# EAGLE schematic BE_PROJECT_PCB_final (EAGLE 9.5.2)

## Sheet 1 of 3
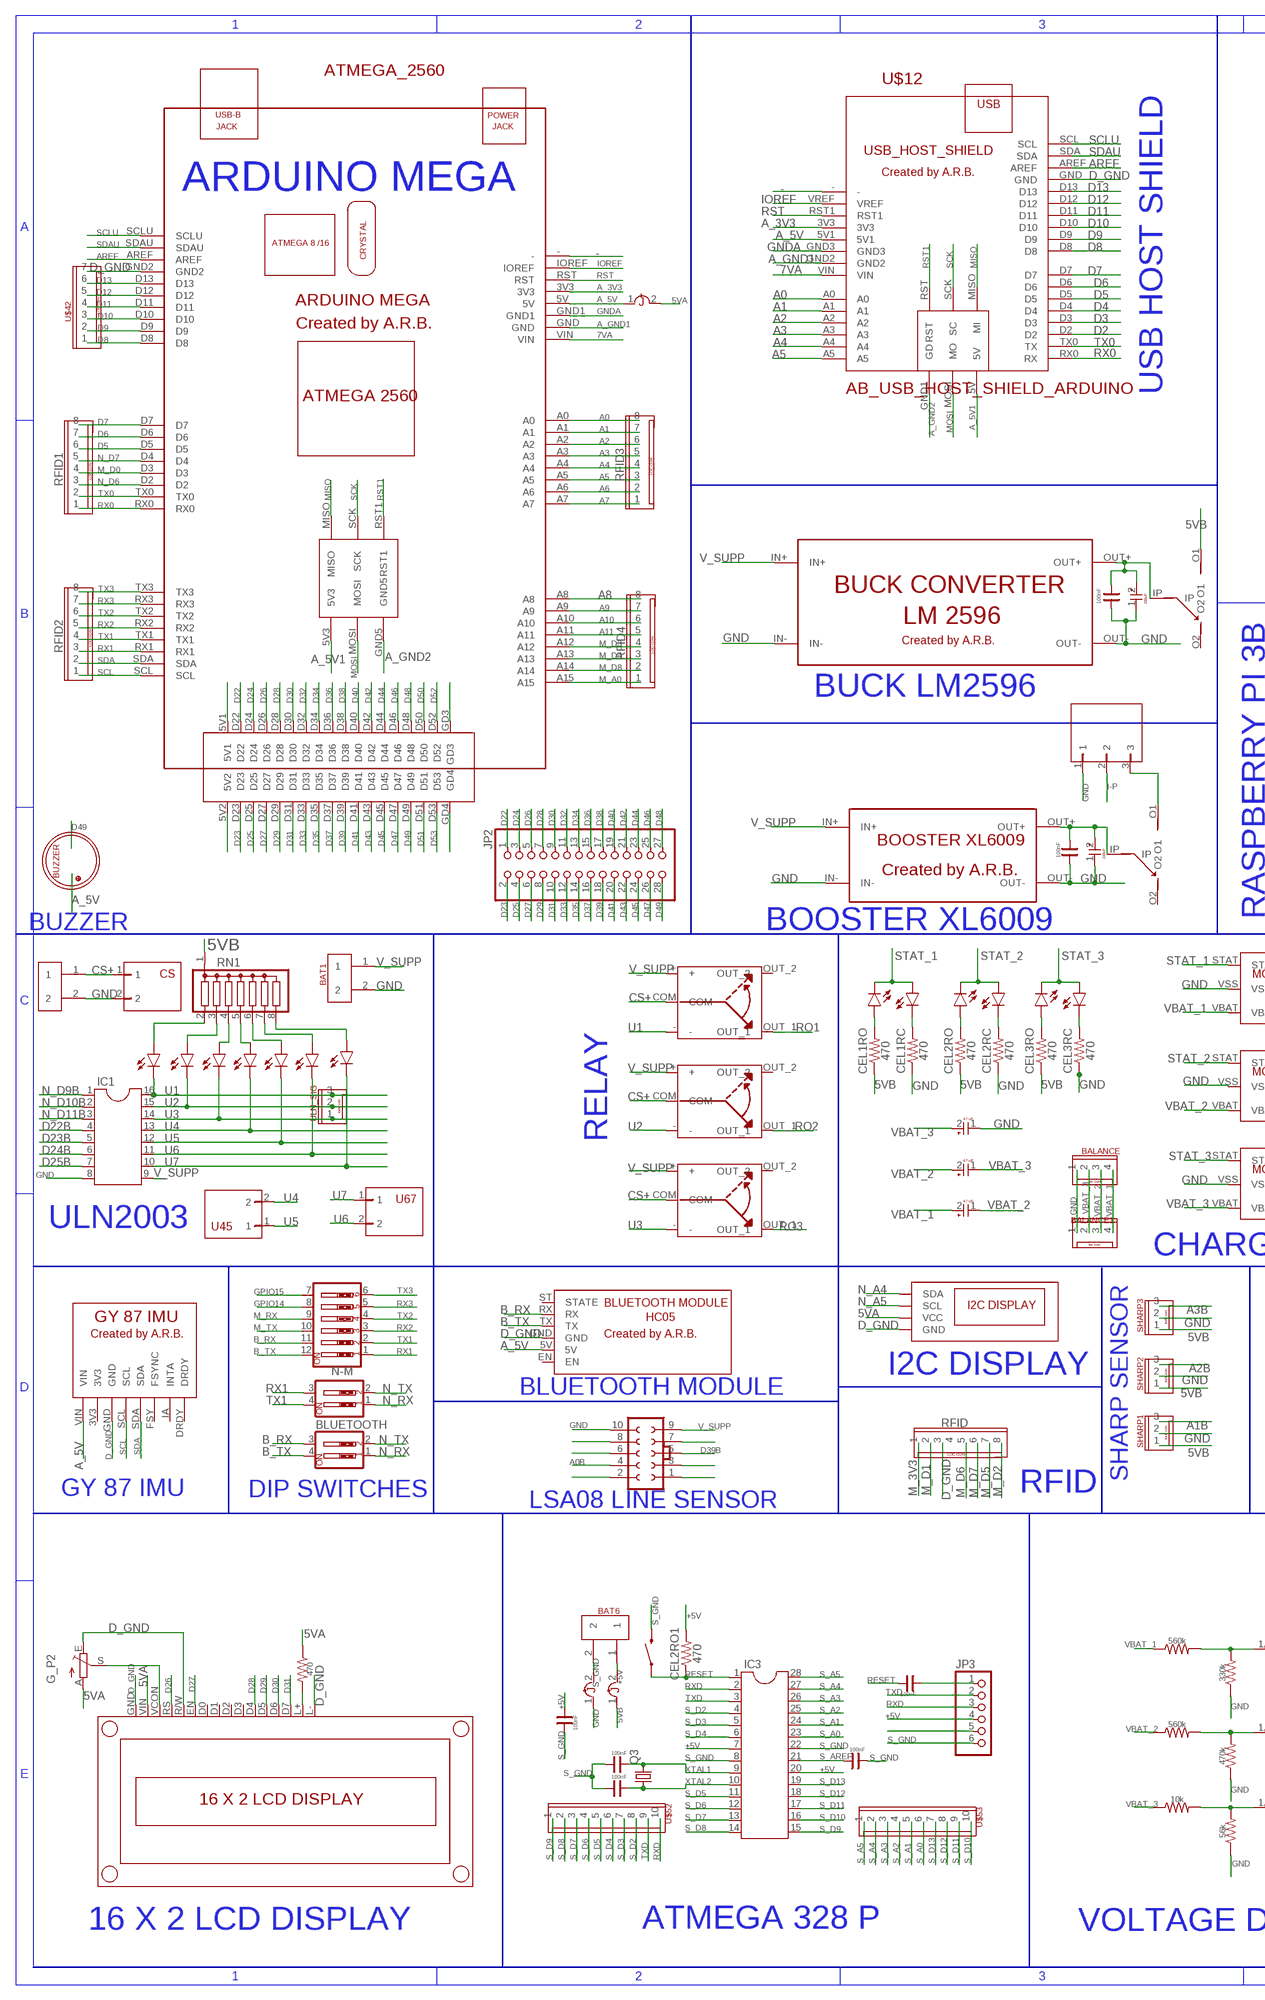
[diagram p0: schematic, sheet 1, part 1 of 3]
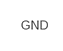
[diagram p1: schematic, sheet 1, part 2 of 3]
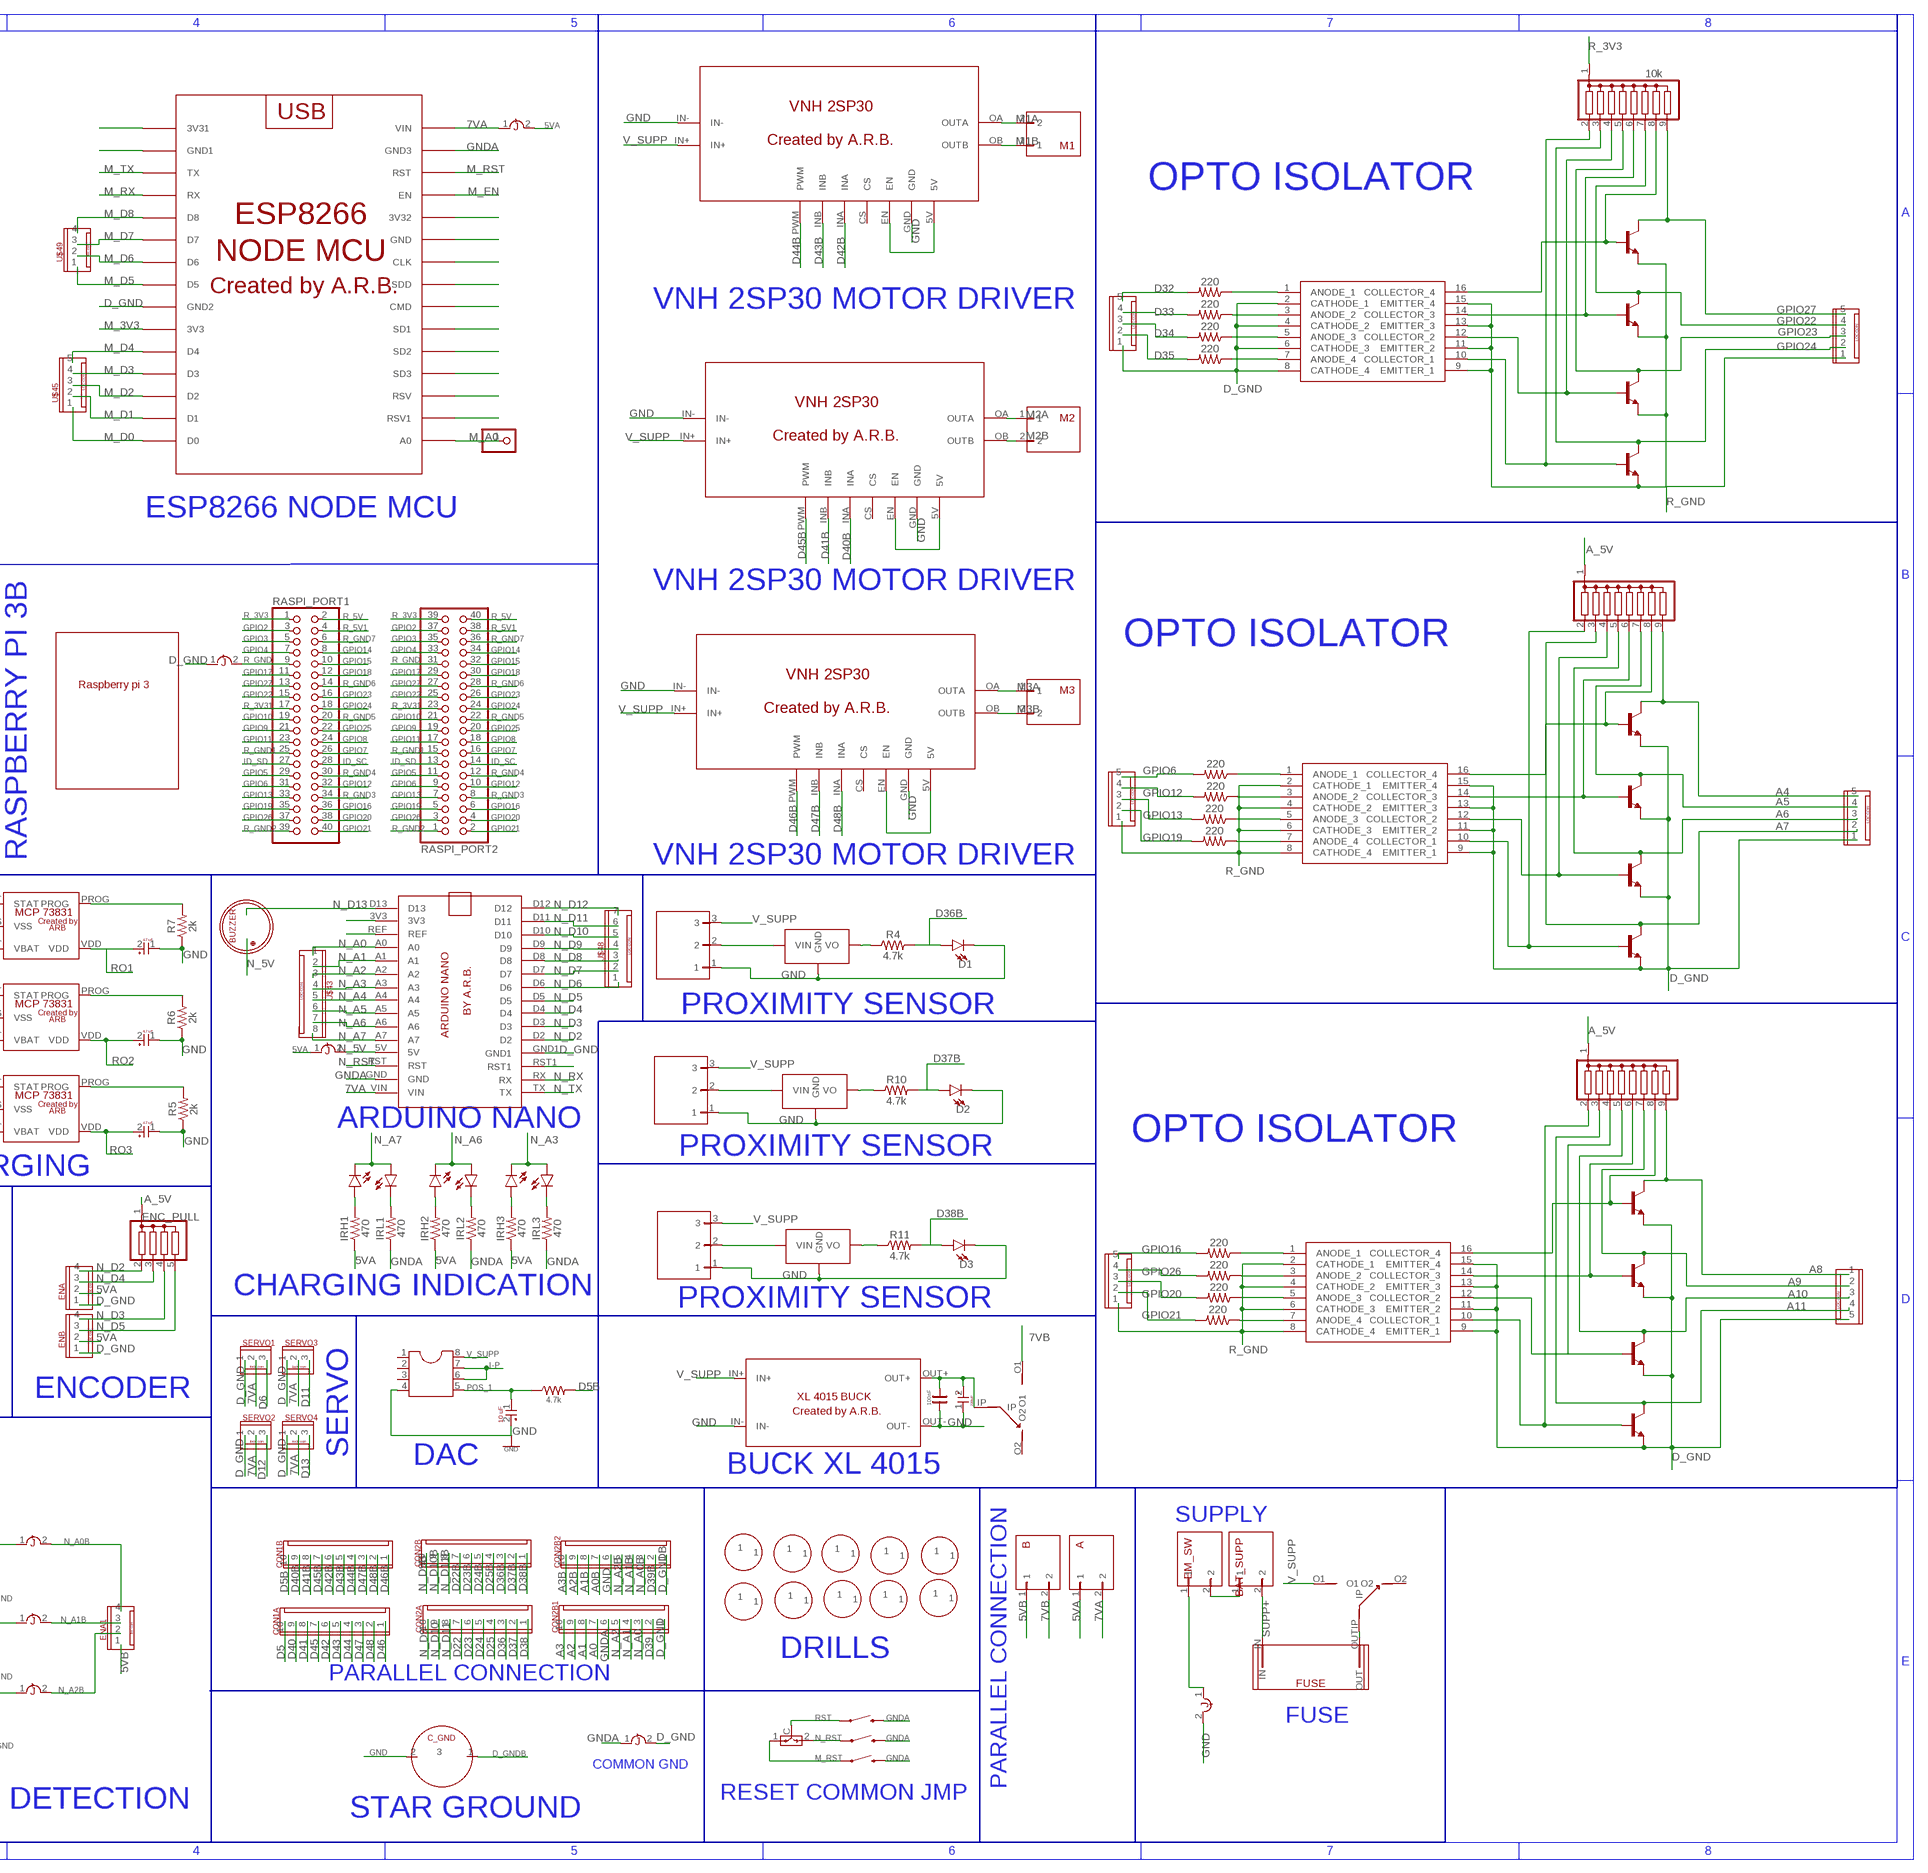
[diagram p2: schematic, sheet 1, part 3 of 3]

### Parts
10K  10k  G08R  [SIL9]
A  AB_RIGHT_TER_BLK  [AB_RIGHT_TER_BLK]
ATMEGA_2560  AB_ARDUINO_MEGA  [AB_ARDUINO_MEGA]
B  AB_RIGHT_TER_BLK  [AB_RIGHT_TER_BLK]
BALANCE  AB_4PIN_LOC_CONNECTOR  [AB_4PIN_LOC_CONNECTOR]
BALANCE1  AB_4PIN_LOC_CONNECTOR  [AB_4PIN_LOC_CONNECTOR]
BAT1  AB_SCREW_TERMINAL_5MM_2PIN  [AB_SCREW_TERMINAL_5MM_2PIN]
BAT6  AB_SCREW_TERMINAL_5MM_2PIN  [AB_SCREW_TERMINAL_5MM_2PIN]
BAT_SUPP  AB_RIGHT_TER_BLK  [AB_RIGHT_TER_BLK]
BC547  BC547  [TO92]
BLUETOOTH  SW_DIP-2  [EDG-02]
C1  100nF  CNP-C020-035X018  [C020-035X018]
C2  100nF  CNP-C020-035X018  [C020-035X018]
C3  100nF  CNP-C020-035X018  [C020-035X018]
C4  100nF  CNP-C020-035X018  [C020-035X018]
C5  100nF  CNP-C020-035X018  [C020-035X018]
C6  100nF  CNP-C020-035X018  [C020-035X018]
C7  100nF  CNP-C020-035X018  [C020-035X018]
C8  100nF  CNP-C020-035X018  [C020-035X018]
C_GND  AB_JOINT_GND  [AB_JOINT_GND]
CEL1CC  LED-3MM-NO_SILK  [LED_3MM-NS]
CEL1CO  LED-3MM-NO_SILK  [LED_3MM-NS]
CEL1RC  470  RESISTORAXIAL-0.3  [AXIAL-0.3]
CEL1RO  470  RESISTORAXIAL-0.3  [AXIAL-0.3]
CEL2CC  LED-3MM-NO_SILK  [LED_3MM-NS]
CEL2CO  LED-3MM-NO_SILK  [LED_3MM-NS]
CEL2RC  470  RESISTORAXIAL-0.3  [AXIAL-0.3]
CEL2RO  470  RESISTORAXIAL-0.3  [AXIAL-0.3]
CEL2RO1  470  RESISTORAXIAL-0.3  [AXIAL-0.3]
CEL3CC  LED-3MM-NO_SILK  [LED_3MM-NS]
CEL3CO  LED-3MM-NO_SILK  [LED_3MM-NS]
CEL3RC  470  RESISTORAXIAL-0.3  [AXIAL-0.3]
CEL3RO  470  RESISTORAXIAL-0.3  [AXIAL-0.3]
CON1A  AB_10PIN_LOC_CONNECTOR  [AB_10PIN_LOC_CONNECTOR]
CON1B  AB_10PIN_LOC_CONNECTOR  [AB_10PIN_LOC_CONNECTOR]
CON2A  AB_10PIN_LOC_CONNECTOR  [AB_10PIN_LOC_CONNECTOR]
CON2B  AB_10PIN_LOC_CONNECTOR  [AB_10PIN_LOC_CONNECTOR]
CON2B1  AB_10PIN_LOC_CONNECTOR  [AB_10PIN_LOC_CONNECTOR]
CON2B2  AB_10PIN_LOC_CONNECTOR  [AB_10PIN_LOC_CONNECTOR]
CS  AB_RIGHT_TER_BLK  [AB_RIGHT_TER_BLK]
D1  LED-3MM-NO_SILK  [LED_3MM-NS]
D2  LED-3MM-NO_SILK  [LED_3MM-NS]
D3  LED-3MM-NO_SILK  [LED_3MM-NS]
EM_SW  AB_RIGHT_TER_BLK  [AB_RIGHT_TER_BLK]
ENA  AB_4PIN_LOC_CONNECTOR  [AB_4PIN_LOC_CONNECTOR]
ENA1  AB_4PIN_LOC_CONNECTOR  [AB_4PIN_LOC_CONNECTOR]
ENB  AB_4PIN_LOC_CONNECTOR  [AB_4PIN_LOC_CONNECTOR]
ENC_PULL  G04R  [SIL5]
FUSE  AB_FUSE_HOLDER  [AB_FUSE_HOLDER]
G_P2  TRIM_EU-RS3  [RS3]
IC1  DIL16S  [SOCKET-16]
IC2  DIL8S  [SOCKET-08]
IC3  DIL28-3  [DIL28-3]
IC8  TLP281-4(GB,J,F)  [SOIC127P700X210-16N]
IC9  TLP281-4(GB,J,F)  [SOIC127P700X210-16N]
IC10  TLP281-4(GB,J,F)  [SOIC127P700X210-16N]
IH1  LED-3MM-NO_SILK  [LED_3MM-NS]
IH2  LED-3MM-NO_SILK  [LED_3MM-NS]
IH3  LED-3MM-NO_SILK  [LED_3MM-NS]
IL1  LED-3MM-NO_SILK  [LED_3MM-NS]
IL2  LED-3MM-NO_SILK  [LED_3MM-NS]
IL3  LED-3MM-NO_SILK  [LED_3MM-NS]
IRH1  470  RESISTORAXIAL-0.3  [AXIAL-0.3]
IRH2  470  RESISTORAXIAL-0.3  [AXIAL-0.3]
IRH3  470  RESISTORAXIAL-0.3  [AXIAL-0.3]
IRL1  470  RESISTORAXIAL-0.3  [AXIAL-0.3]
IRL2  470  RESISTORAXIAL-0.3  [AXIAL-0.3]
IRL3  470  RESISTORAXIAL-0.3  [AXIAL-0.3]
JP1  PINHD-1X1  [1X01]
JP2  PINHD-2X14  [2X14]
JP3  PINHD-1X6  [1X06]
L1  LED-3MM-NO_SILK  [LED_3MM-NS]
L2  LED-3MM-NO_SILK  [LED_3MM-NS]
L3  LED-3MM-NO_SILK  [LED_3MM-NS]
L4  LED-3MM-NO_SILK  [LED_3MM-NS]
L5  LED-3MM-NO_SILK  [LED_3MM-NS]
L6  LED-3MM-NO_SILK  [LED_3MM-NS]
L7  LED-3MM-NO_SILK  [LED_3MM-NS]
LSA_2  LSA1  SOCKET-10V  [S10V]
M1  AB_RIGHT_TER_BLK  [AB_RIGHT_TER_BLK]
M2  AB_RIGHT_TER_BLK  [AB_RIGHT_TER_BLK]
M3  AB_RIGHT_TER_BLK  [AB_RIGHT_TER_BLK]
M_RST  MOMENTARY-SWITCH-SPST-PTH-6.0MM  [TACTILE_SWITCH_PTH_6.0MM]
MEGA_RST  MOMENTARY-SWITCH-SPST-PTH-6.0MM  [TACTILE_SWITCH_PTH_6.0MM]
MEGA_RST1  MOMENTARY-SWITCH-SPST-PTH-6.0MM  [TACTILE_SWITCH_PTH_6.0MM]
N-M  SW_DIP-2  [EDG-02]
N_RST  MOMENTARY-SWITCH-SPST-PTH-6.0MM  [TACTILE_SWITCH_PTH_6.0MM]
NANO  AB_JUMPER_ONE_WAY  [AB_JUMPER_ONE_WAY]
NODEMCU  AB_JUMPER_ONE_WAY  [AB_JUMPER_ONE_WAY]
OISO1  AB_5PIN_LOC_CONNECTOR  [AB_5PIN_LOC_CONNECTOR]
OISO2  AB_5PIN_LOC_CONNECTOR  [AB_5PIN_LOC_CONNECTOR]
OISO3  AB_5PIN_LOC_CONNECTOR  [AB_5PIN_LOC_CONNECTOR]
OISO4  AB_5PIN_LOC_CONNECTOR  [AB_5PIN_LOC_CONNECTOR]
OISO5  AB_5PIN_LOC_CONNECTOR  [AB_5PIN_LOC_CONNECTOR]
OISO6  AB_5PIN_LOC_CONNECTOR  [AB_5PIN_LOC_CONNECTOR]
PPR_R1  4.7k  RESISTORAXIAL-0.3  [AXIAL-0.3]
PROX1  AB_RIGHT_TER_BLK_3PIN  [AB_RIGHT_TER_BLK_3PIN]
PROX2  AB_RIGHT_TER_BLK_3PIN  [AB_RIGHT_TER_BLK_3PIN]
PROX3  AB_RIGHT_TER_BLK_3PIN  [AB_RIGHT_TER_BLK_3PIN]
Q3  CRYSTALHC49U-V  [HC49U-V]
R2  560k  RESISTORAXIAL-0.3  [AXIAL-0.3]
R4  4.7k  RESISTORAXIAL-0.3  [AXIAL-0.3]
R5  2k  RESISTORAXIAL-0.3  [AXIAL-0.3]
R6  2k  RESISTORAXIAL-0.3  [AXIAL-0.3]
R7  2k  RESISTORAXIAL-0.3  [AXIAL-0.3]
R10  4.7k  RESISTORAXIAL-0.3  [AXIAL-0.3]
R11  4.7k  RESISTORAXIAL-0.3  [AXIAL-0.3]
R17  470  RESISTORAXIAL-0.3  [AXIAL-0.3]
R18  220  RESISTORAXIAL-0.3  [AXIAL-0.3]
R19  220  RESISTORAXIAL-0.3  [AXIAL-0.3]
R20  220  RESISTORAXIAL-0.3  [AXIAL-0.3]
R21  220  RESISTORAXIAL-0.3  [AXIAL-0.3]
R22  220  RESISTORAXIAL-0.3  [AXIAL-0.3]
R23  220  RESISTORAXIAL-0.3  [AXIAL-0.3]
R24  220  RESISTORAXIAL-0.3  [AXIAL-0.3]
R25  220  RESISTORAXIAL-0.3  [AXIAL-0.3]
R26  220  RESISTORAXIAL-0.3  [AXIAL-0.3]
R27  220  RESISTORAXIAL-0.3  [AXIAL-0.3]
R28  220  RESISTORAXIAL-0.3  [AXIAL-0.3]
R32  220  RESISTORAXIAL-0.3  [AXIAL-0.3]
R34  330k  RESISTORAXIAL-0.3  [AXIAL-0.3]
R35  560k  RESISTORAXIAL-0.3  [AXIAL-0.3]
R36  470k  RESISTORAXIAL-0.3  [AXIAL-0.3]
R37  10k  RESISTORAXIAL-0.3  [AXIAL-0.3]
R38  56k  RESISTORAXIAL-0.3  [AXIAL-0.3]
RASPI_PORT1  PINHD-2X20  [2X20]
RASPI_PORT2  PINHD-2X20  [2X20]
REL1  12v  AB_ELECTROMAGNETIC_RELAY  [AB_ELECTROMAGNETIC_RELAY]
REL2  12v  AB_ELECTROMAGNETIC_RELAY  [AB_ELECTROMAGNETIC_RELAY]
REL3  12v  AB_ELECTROMAGNETIC_RELAY  [AB_ELECTROMAGNETIC_RELAY]
RFID  AB_8PIN_LOC_CONNECTOR  [AB_8PIN_LOC_CONNECTOR]
RFID1  AB_8PIN_LOC_CONNECTOR  [AB_8PIN_LOC_CONNECTOR]
RFID2  AB_8PIN_LOC_CONNECTOR  [AB_8PIN_LOC_CONNECTOR]
RFID3  AB_8PIN_LOC_CONNECTOR  [AB_8PIN_LOC_CONNECTOR]
RFID4  AB_8PIN_LOC_CONNECTOR  [AB_8PIN_LOC_CONNECTOR]
RN1  G07R  [SIL8]
RN6  G08R  [SIL9]
RN7  G08R  [SIL9]
SERVO1  AB_3PIN_LOC_CONNECTOR  [AB_3PIN_LOC_CONNECTOR]
SERVO2  AB_3PIN_LOC_CONNECTOR  [AB_3PIN_LOC_CONNECTOR]
SERVO3  AB_3PIN_LOC_CONNECTOR  [AB_3PIN_LOC_CONNECTOR]
SERVO4  AB_3PIN_LOC_CONNECTOR  [AB_3PIN_LOC_CONNECTOR]
SHARP1  AB_3PIN_LOC_CONNECTOR  [AB_3PIN_LOC_CONNECTOR]
SHARP2  AB_3PIN_LOC_CONNECTOR  [AB_3PIN_LOC_CONNECTOR]
SHARP3  AB_3PIN_LOC_CONNECTOR  [AB_3PIN_LOC_CONNECTOR]
SW1  SW_DIP-6  [EDG-06]
TR14  BC547  [TO92]
TR15  BC547  [TO92]
TR16  BC547  [TO92]
TR17  BC547  [TO92]
TR18  BC547  [TO92]
TR19  BC547  [TO92]
TR20  BC547  [TO92]
TR21  BC547  [TO92]
TR22  BC547  [TO92]
TR23  BC547  [TO92]
TR24  BC547  [TO92]
U45  AB_RIGHT_TER_BLK  [AB_RIGHT_TER_BLK]
U67  AB_RIGHT_TER_BLK  [AB_RIGHT_TER_BLK]
U$1  AB_JUMPER_ONE_WAY  [AB_JUMPER_ONE_WAY]
U$2  AB_16X2_LCD_DISPLAY  [AB_16X2_LCD_DISPLAY]
U$3  AB_VNH2SP30  [AB_VNH2SP30_MODULE]
U$4  ESP8266_NODEMCU_BY_AB  [AB_ESP8266_BREAKOUT]
U$5  AB_RASPBERRY_PI_3  [AB_RASPBERRY_PI_3]
U$6  AB_VNH2SP30  [AB_VNH2SP30_MODULE]
U$7  AB_LM2596_BUCK_CONVERTER  [AB_LM2596_BUCK_CONVERTER]
U$8  AB_XL6009_BOOST_CONVERTER  [AB_XL6009E1_BOOST_CONVERTER]
U$9  AB_VNH2SP30  [AB_VNH2SP30_MODULE]
U$10  AB_GY87  [AB_IMU_GY87]
U$11  AB_BLUETOOTH_HC05  [AB_BLUETOOTH_HC05]
U$12  AB_USB_HOST_SHIELD_ARDUINO  [AB_USB_HOST_SHIELD_ARDUINO]
U$13  AB_XL4015_5A_  [AB_XL_4015_5A_BUCK]
U$14  AB_SW  [AB_SW]
U$15  AB_SW  [AB_SW]
U$16  AB_SW  [AB_SW]
U$17  AB_JUMPER_ONE_WAY  [AB_JUMPER_ONE_WAY]
U$18  AB_MCP_73831_LIPO_CHARGER  [AB_MCP_73831_LIPO_CHARGER]
U$19  AB_MCP_73831_LIPO_CHARGER  [AB_MCP_73831_LIPO_CHARGER]
U$20  AB_MCP_73831_LIPO_CHARGER  [AB_MCP_73831_LIPO_CHARGER]
U$21  4.7 uF  AB_POL_CAP  [AB_POL_CAP]
U$22  4.7 uF  AB_POL_CAP  [AB_POL_CAP]
U$23  4.7 uF  AB_POL_CAP  [AB_POL_CAP]
U$24  AB_0.91_INCH_I2C_DISPLAY  [AB_0.91INCH_I2C_DISPLAY]
U$25  4.7 uF  AB_POL_CAP  [AB_POL_CAP]
U$26  4.7 uF  AB_POL_CAP  [AB_POL_CAP]
U$27  4.7 uF  AB_POL_CAP  [AB_POL_CAP]
U$28  AB_BUZZER  [AB_BUZZER]
U$29  10 uF  AB_POL_CAP  [AB_POL_CAP]
U$30  AB_JUMPER_TWO_WAY  [AB_JUMPER_TWO_WAY]
U$31  AB_JUMPER_ONE_WAY  [AB_JUMPER_ONE_WAY]
U$32  AB_SW  [AB_SW]
U$33  AB_JUMPER_ONE_WAY  [AB_JUMPER_ONE_WAY]
U$34  220uF  AB_POL_CAP  [AB_POL_CAP]
U$35  AB_ARDUINO_NANO  [AB_ARDUINO_NANO]
U$36  AB_SCREW_TERMINAL_5MM_2PIN  [AB_SCREW_TERMINAL_5MM_2PIN]
U$37  220uF  AB_POL_CAP  [AB_POL_CAP]
U$38  220uF  AB_POL_CAP  [AB_POL_CAP]
U$39  AB_BUZZER  [AB_BUZZER]
U$40  AB_JUMPER_ONE_WAY  [AB_JUMPER_ONE_WAY]
U$41  AB_JUMPER_ONE_WAY  [AB_JUMPER_ONE_WAY]
U$42  AB_7PIN_LOC_CONNECTOR  [AB_7PIN_LOC_CONNECTOR]
U$43  AB_8PIN_LOC_CONNECTOR  [AB_8PIN_LOC_CONNECTOR]
U$44  AB_7805_FLAT  [AB_7805_FLAT]
U$45  AB_5PIN_LOC_CONNECTOR  [AB_5PIN_LOC_CONNECTOR]
U$46  AB_7805_FLAT  [AB_7805_FLAT]
U$47  AB_7805_FLAT  [AB_7805_FLAT]
U$48  AB_7PIN_LOC_CONNECTOR  [AB_7PIN_LOC_CONNECTOR]
U$49  AB_4PIN_LOC_CONNECTOR  [AB_4PIN_LOC_CONNECTOR]
U$50  AB_JUMPER_ONE_WAY  [AB_JUMPER_ONE_WAY]
U$51  AB_JUMPER_ONE_WAY  [AB_JUMPER_ONE_WAY]
U$52  AB_10PIN_LOC_CONNECTOR  [AB_10PIN_LOC_CONNECTOR]
U$53  AB_10PIN_LOC_CONNECTOR  [AB_10PIN_LOC_CONNECTOR]
U$54  AB_PLATED_DRILL_160MIL  [AB_PLATED_DRILL_160MIL]
U$55  AB_PLATED_DRILL_160MIL  [AB_PLATED_DRILL_160MIL]
U$56  AB_PLATED_DRILL_160MIL  [AB_PLATED_DRILL_160MIL]
U$57  AB_PLATED_DRILL_160MIL  [AB_PLATED_DRILL_160MIL]
U$58  AB_PLATED_DRILL_160MIL  [AB_PLATED_DRILL_160MIL]
U$59  AB_PLATED_DRILL_160MIL  [AB_PLATED_DRILL_160MIL]
U$60  AB_PLATED_DRILL_160MIL  [AB_PLATED_DRILL_160MIL]
U$61  AB_PLATED_DRILL_160MIL  [AB_PLATED_DRILL_160MIL]
U$62  AB_JUMPER_ONE_WAY  [AB_JUMPER_ONE_WAY]
U$63  AB_PLATED_DRILL_160MIL  [AB_PLATED_DRILL_160MIL]
U$64  AB_PLATED_DRILL_160MIL  [AB_PLATED_DRILL_160MIL]
ULN_SIG  AB_3PIN_LOC_CONNECTOR  [AB_3PIN_LOC_CONNECTOR]
V-P  AB_RIGHT_TER_BLK_3PIN  [AB_RIGHT_TER_BLK_3PIN]

### Nets
5VA: A.1 ENA.2 ENB.2 G_P2.A IRH1.P$1 IRH2.P$1 IRH3.P$1 NANO.1 NODEMCU.2 R17.P$1 U$2.VIN U$24.VCC U$31.2
5VB: B.1 CEL1RO.P$1 CEL2RO.P$1 CEL3RO.P$1 ENA1.1 RN1.1 SHARP1.1 SHARP2.1 SHARP3.1 U$14.O1 U$50.1
7VA [GND]: A.2 ATMEGA_2560.VIN NODEMCU.1 SERVO1.2 SERVO2.2 SERVO3.2 SERVO4.2 U$4.VIN U$12.VIN U$35.VIN
7VB [GND]: B.2 U$16.O1
+5V: BAT6.1 C5.1 CEL2RO1.P$2 IC3.7 IC3.20 JP3.4 U$50.2
-: ATMEGA_2560.- U$12.-
A0: ATMEGA_2560.A0 CON2B1.7 RFID3.8 U$12.A0
A0B: CON2B2.7 LSA_2.4
A1: ATMEGA_2560.A1 CON2B1.8 RFID3.7 U$12.A1
A1B: CON2B2.8 SHARP1.3
A2: ATMEGA_2560.A2 CON2B1.9 RFID3.6 U$12.A2
A2B: CON2B2.9 SHARP2.3
A3: ATMEGA_2560.A3 CON2B1.10 RFID3.5 U$12.A3
A3B: CON2B2.10 SHARP3.3
A4: ATMEGA_2560.A4 OISO4.5 RFID3.4 RN6.9 TR17.3(C) U$12.A4
A5: ATMEGA_2560.A5 OISO4.4 RFID3.3 RN6.7 TR18.3(C) U$12.A5
A6: ATMEGA_2560.A6 OISO4.3 RFID3.2 RN6.5 TR19.3(C)
A7: ATMEGA_2560.A7 OISO4.2 RFID3.1 RN6.3 TR20.3(C)
A8: ATMEGA_2560.A8 OISO6.1 RFID4.8 RN7.9 TR21.3(C)
A9: ATMEGA_2560.A9 OISO6.2 RFID4.7 RN7.7 TR22.3(C)
A10: ATMEGA_2560.A10 OISO6.3 RFID4.6 RN7.5 TR23.3(C)
A11: ATMEGA_2560.A11 OISO6.4 RFID4.5 RN7.3 TR24.3(C)
A_3V3: ATMEGA_2560.3V3 U$12.3V3
A_5V: ATMEGA_2560.5V ENC_PULL.1 RN6.1 RN7.1 U$10.VIN U$11.5V U$12.5V1 U$31.1 U$39.+
A_5V1: ATMEGA_2560.5V3 U$12.5V
A_GND1: ATMEGA_2560.GND U$12.GND2
A_GND2: ATMEGA_2560.GND5 U$12.GND1(GD)
AREF: ATMEGA_2560.AREF U$12.AREF
B_RX: BLUETOOTH.3 SW1.11 U$11.RX
B_TX: BLUETOOTH.4 SW1.12 U$11.TX
CS+: CS.1 REL1.COM REL2.COM REL3.COM U$36.1
D2: U$12.D2
D3: U$12.D3
D4: U$12.D4
D5: ATMEGA_2560.D5 CON1A.10 RFID1.6 U$12.D5
D5B: CON1B.10 PPR_R1.P$2
D6: ATMEGA_2560.D6 RFID1.7 SERVO1.3 U$12.D6
D7: ATMEGA_2560.D7 RFID1.8 U$12.D7
D8: ATMEGA_2560.D8 U$12.D8 U$42.1
D9: ATMEGA_2560.D9 U$12.D9 U$42.2
D10: ATMEGA_2560.D10 U$12.D10 U$42.3
D11: ATMEGA_2560.D11 SERVO3.3 U$12.D11 U$42.4
D12: ATMEGA_2560.D12 SERVO2.3 U$12.D12 U$42.5
D13: ATMEGA_2560.D13 SERVO4.3 U$12.D13 U$42.6
D22: ATMEGA_2560.D22 CON2A.7 JP2.1
D22B: CON2B.7 IC1.4
D23: ATMEGA_2560.D23 CON2A.6 JP2.2
D23B: CON2B.6 IC1.5
D24: ATMEGA_2560.D24 CON2A.5 JP2.3
D24B: CON2B.5 IC1.6
D25: ATMEGA_2560.D25 CON2A.4 JP2.4
D25B: CON2B.4 IC1.7
D26: ATMEGA_2560.D26 JP2.5 U$2.RS
D27: ATMEGA_2560.D27 JP2.6 U$2.EN
D28: ATMEGA_2560.D28 JP2.7 U$2.D4
D29: ATMEGA_2560.D29 JP2.8 U$2.D5
D30: ATMEGA_2560.D30 JP2.9 U$2.D6
D31: ATMEGA_2560.D31 JP2.10 U$2.D7
D32: ATMEGA_2560.D32 JP2.11 OISO1.5 R32.P$2
D33: ATMEGA_2560.D33 JP2.12 OISO1.4 R18.P$2
D34: ATMEGA_2560.D34 JP2.13 OISO1.3 R19.P$2
D35: ATMEGA_2560.D35 JP2.14 OISO1.2 R20.P$2
D36: ATMEGA_2560.D36 CON2A.3 JP2.15
D36B: CON2B.3 D1.A R4.P$2
D37: ATMEGA_2560.D37 CON2A.2 JP2.16
D37B: CON2B.2 D2.A R10.P$2
D38: ATMEGA_2560.D38 CON2A.1 JP2.17
D38B: CON2B.1 D3.A R11.P$2
D39: ATMEGA_2560.D39 CON2B1.2 JP2.18
D39B: CON2B2.2 LSA_2.5
D40: ATMEGA_2560.D40 CON1A.9 JP2.19
D40B: CON1B.9 U$6.INA
D41: ATMEGA_2560.D41 CON1A.8 JP2.20
D41B: CON1B.8 U$6.INB
D42: ATMEGA_2560.D42 CON1A.6 JP2.21
D42B: CON1B.6 U$3.INA
D43: ATMEGA_2560.D43 CON1A.5 JP2.22
D43B: CON1B.5 U$3.INB
D44: ATMEGA_2560.D44 CON1A.4 JP2.23
D44B: CON1B.4 U$3.PWM
D45: ATMEGA_2560.D45 CON1A.7 JP2.24
D45B: CON1B.7 U$6.PWM
D46: ATMEGA_2560.D46 CON1A.1 JP2.25
D46B: CON1B.1 U$9.PWM
D47: ATMEGA_2560.D47 CON1A.3 JP2.26
D47B: CON1B.3 U$9.INB
D48: ATMEGA_2560.D48 CON1A.2 JP2.27
D48B: CON1B.2 U$9.INA
D49: ATMEGA_2560.D49 JP2.28 U$39.-
D50: ATMEGA_2560.D50
D51: ATMEGA_2560.D51
D52: ATMEGA_2560.D52
D53: ATMEGA_2560.D53
D_GND: ATMEGA_2560.GND2 CON2B1.1 ENA.1 ENB.1 G_P2.E IC8.2(CATHODE_1) IC8.4(CATHODE_2) IC8.6(CATHODE_3) IC8.8(CATHODE_4) IC9.9(EMITTER_1) IC9.11(EMITTER_2) IC9.13(EMITTER_3) IC9.15(EMITTER_4) IC10.9(EMITTER_1) IC10.11(EMITTER_2) IC10.13(EMITTER_3) IC10.15(EMITTER_4) OISO1.1 OISO4.1 OISO6.5 RFID.3 SERVO1.1 SERVO2.1 SERVO3.1 SERVO4.1 TR17.1(E) TR18.1(E) TR19.1(E) TR20.1(E) TR21.1(E) TR22.1(E) TR23.1(E) TR24.1(E) U$2.GND U$2.L- U$2.R/W U$4.GND2 U$10.GND U$11.GND U$12.GND U$17.1 U$24.GND U$35.GND1 U$42.7 U$62.2
D_GNDB: C_GND.1 CON2B2.1
GND: BALANCE1.1 BALANCE.1 BAT1.2 C1.1 C3.1 C4.1 C_GND.2 CEL1RC.P$1 CEL2RC.P$1 CEL3RC.P$1 CON2B2.6 CS.2 D1.K(C) D2.K(C) D3.K(C) IC1.8 IC2.4 LSA_2.10 PROX1.1 PROX2.1 PROX3.1 R5.P$1 R6.P$1 R7.P$1 R34.P$1 R36.P$1 R38.P$1 SHARP1.2 SHARP2.2 SHARP3.2 U$3.GND U$3.IN- U$6.GND U$6.IN- U$7.IN- U$7.OUT- U$8.IN- U$8.OUT- U$9.GND U$9.IN- U$13.IN- U$13.OUT- U$18.VSS U$19.VSS U$20.VSS U$23.1 U$25.1 U$26.1 U$27.1 U$29.2 U$33.2 U$34.1 U$36.2 U$37.1 U$38.1 U$44.2(GND) U$46.2(GND) U$47.2(GND) U$51.1 V-P.1
GNDA: ATMEGA_2560.GND1 CON2B1.6 IRL1.P$1 IRL2.P$1 IRL3.P$1 M_RST.3 MEGA_RST.3 N_RST.3 U$4.GND3 U$12.GND3 U$35.GND U$62.1
GPIO2: RASPI_PORT1.3 RASPI_PORT2.37
GPIO3: RASPI_PORT1.5 RASPI_PORT2.35
GPIO4: RASPI_PORT1.7 RASPI_PORT2.33
GPIO5: RASPI_PORT1.29 RASPI_PORT2.11
GPIO6: OISO3.5 R21.P$2 RASPI_PORT1.31 RASPI_PORT2.9
GPIO7: RASPI_PORT1.26 RASPI_PORT2.16
GPIO8: RASPI_PORT1.24 RASPI_PORT2.18
GPIO9: RASPI_PORT1.21 RASPI_PORT2.19
GPIO10: RASPI_PORT1.19 RASPI_PORT2.21
GPIO11: RASPI_PORT1.23 RASPI_PORT2.17
GPIO12: OISO3.4 R22.P$2 RASPI_PORT1.32 RASPI_PORT2.10
GPIO13: OISO3.3 R23.P$2 RASPI_PORT1.33 RASPI_PORT2.7
GPIO14: RASPI_PORT1.8 RASPI_PORT2.34 SW1.8
GPIO15: RASPI_PORT1.10 RASPI_PORT2.32 SW1.7
GPIO16: OISO5.5 R25.P$2 RASPI_PORT1.36 RASPI_PORT2.6
GPIO17: RASPI_PORT1.11 RASPI_PORT2.29
GPIO18: RASPI_PORT1.12 RASPI_PORT2.30
GPIO19: OISO3.2 R24.P$2 RASPI_PORT1.35 RASPI_PORT2.5
GPIO20: OISO5.3 R27.P$2 RASPI_PORT1.38 RASPI_PORT2.4
GPIO21: OISO5.2 R28.P$2 RASPI_PORT1.40 RASPI_PORT2.2
GPIO22: 10K.7 OISO2.4 RASPI_PORT1.15 RASPI_PORT2.25 TR14.3(C)
GPIO23: 10K.5 OISO2.3 RASPI_PORT1.16 RASPI_PORT2.26 TR15.3(C)
GPIO24: 10K.3 OISO2.2 RASPI_PORT1.18 RASPI_PORT2.24 TR16.3(C)
GPIO25: RASPI_PORT1.22 RASPI_PORT2.20
GPIO26: OISO5.4 R26.P$2 RASPI_PORT1.37 RASPI_PORT2.3
GPIO27: 10K.9 BC547.3(C) OISO2.5 RASPI_PORT1.13 RASPI_PORT2.27
I-P: IC2.6 IC2.7 V-P.2
ID_SC: RASPI_PORT1.28 RASPI_PORT2.14
ID_SD: RASPI_PORT1.27 RASPI_PORT2.13
IOREF: ATMEGA_2560.IOREF U$12.VREF
M1A: M1.2 U$3.OA(OUTA)
M1B: M1.1 U$3.OB(OUTB)
M2A: M2.1 U$6.OA(OUTA)
M2B: M2.2 U$6.OB(OUTB)
M3A: M3.1 U$9.OA(OUTA)
M3B: M3.2 U$9.OB(OUTB)
M_3V3: RFID.1 U$4.3V3
M_A0: ATMEGA_2560.A15 JP1.1 RFID4.1 U$4.A0
M_D0: ATMEGA_2560.D3 RFID1.4 U$4.D0 U$45.1
M_D1: RFID.2 U$4.D1 U$45.2
M_D2: RFID.8 U$4.D2 U$45.3
M_D3: ATMEGA_2560.A12 RFID4.4 U$4.D3 U$45.4
M_D4: ATMEGA_2560.A13 RFID4.3 U$4.D4 U$45.5
M_D5: RFID.7 U$4.D5 U$49.1
M_D6: RFID.5 U$4.D6 U$49.2
M_D7: RFID.6 U$4.D7 U$49.3
M_D8: ATMEGA_2560.A14 RFID4.2 U$4.D8 U$49.4
M_EN: U$4.EN
M_RST: M_RST.1 U$4.RST U$30.1
M_RX: SW1.9 U$4.RX
M_TX: SW1.10 U$4.TX
MISO: ATMEGA_2560.MISO U$12.MISO(MI)
MOSI: ATMEGA_2560.MOSI U$12.MOSI(MO)
N$1: LSA_2.1
N$2: C1.2 U$7.OUT+ U$14.IP U$34.2
N$3: IC10.7(ANODE_4) R28.P$1
N$4: LSA_2.3
N$5: IC9.7(ANODE_4) R24.P$1
N$6: U$15.O1 V-P.3
N$7: G_P2.S U$2.VCON
N$8: PROX1.2 U$44.1(VIN)
N$9: R4.P$1 U$44.3(VO)
N$10: PROX3.2 U$47.1(VIN)
N$11: 10K.4 IC8.12(COLLECTOR_2) TR15.2(B)
N$12: IC9.16(COLLECTOR_4) RN6.8 TR17.2(B)
N$13: R11.P$1 U$47.3(VO)
N$14: R2.P$2 R34.P$2 U$1.1
N$15: LSA_2.7
N$16: EM_SW.1 U$33.1
N$17: 10K.2 IC8.10(COLLECTOR_1) TR16.2(B)
N$18: 10K.8 BC547.2(B) IC8.16(COLLECTOR_4)
N$19: FUSE.OUT U$32.IP
N$20: R35.P$2 R36.P$2 U$40.1
N$21: IC9.10(COLLECTOR_1) RN6.2 TR20.2(B)
N$22: R17.P$2 U$2.L+
N$23: U$3.5V U$3.EN
N$24: U$6.5V U$6.EN
N$25: 10K.6 IC8.14(COLLECTOR_3) TR14.2(B)
N$26: C3.2 U$8.OUT+ U$15.IP U$37.2
N$27: R37.P$2 R38.P$2 U$41.1
N$28: IC9.12(COLLECTOR_2) RN6.4 TR19.2(B)
N$29: IC9.14(COLLECTOR_3) RN6.6 TR18.2(B)
N$30: U$9.5V U$9.EN
N$31: C4.2 U$13.OUT+ U$16.IP U$38.2
N$36: IC10.10(COLLECTOR_1) RN7.2 TR24.2(B)
N$37: LSA_2.8
N$38: IC10.12(COLLECTOR_2) RN7.4 TR23.2(B)
N$40: LSA_2.6
N$41: IC10.14(COLLECTOR_3) RN7.6 TR22.2(B)
N$42: IC10.16(COLLECTOR_4) RN7.8 TR21.2(B)
N$44: CEL2CO.A CEL2RO.P$2
N$45: IH3.A IRH3.P$2
N$46: CEL3CO.A CEL3RO.P$2
N$47: CEL3CC.K(C) CEL3RC.P$2
N$48: CEL2CC.K(C) CEL2RC.P$2
N$49: CEL1CO.A CEL1RO.P$2
N$50: CEL1CC.K(C) CEL1RC.P$2
N$51: U$35.3V3
N$52: U$35.REF
N$53: IL3.K(C) IRL3.P$2
N$54: IH2.A IRH2.P$2
N$55: LSA_2.2
N$56: IL2.K(C) IRL2.P$2
N$57: R7.P$2 U$18.PROG
N$59: IH1.A IRH1.P$2
N$60: R6.P$2 U$19.PROG
N$61: IL1.K(C) IRL1.P$2
N$62: R5.P$2 U$20.PROG
N$65: C2.1 JP3.1
N$69: JP3.5
N$83: ATMEGA_2560.5V1
N$87: L1.A RN1.2
N$88: L2.A RN1.3
N$89: L3.A RN1.4
N$90: L4.A RN1.5
N$91: L5.A RN1.6
N$92: L6.A RN1.7
N$93: L7.A RN1.8
N$100: ATMEGA_2560.GD3
N$101: ATMEGA_2560.5V2
N$105: U$35.RST1
N$118: ATMEGA_2560.GD4
N$157: U$4.3V31
N$158: U$4.GND1
N$175: U$4.3V32
N$176: U$4.GND
N$177: U$4.CLK
N$178: U$4.SDD
N$179: U$4.CMD
N$180: U$4.SD1
N$181: U$4.SD2
N$182: U$4.SD3
N$183: U$4.RSV
N$184: U$4.RSV1
N$199: PROX2.2 U$46.1(VIN)
N$202: R10.P$1 U$46.3(VO)
N$227: IC8.1(ANODE_1) R32.P$1
N$232: IC8.3(ANODE_2) R18.P$1
N$233: IC8.5(ANODE_3) R19.P$1
N$234: IC8.7(ANODE_4) R20.P$1
N$249: IC9.1(ANODE_1) R21.P$1
N$250: IC9.3(ANODE_2) R22.P$1
N$251: IC9.5(ANODE_3) R23.P$1
N$267: IC10.1(ANODE_1) R25.P$1
N$268: IC10.3(ANODE_2) R26.P$1
N$269: IC10.5(ANODE_3) R27.P$1
N_5V: NANO.2 U$28.+ U$35.5V
N_A0: CON2B1.3 U$35.A0 U$43.1
N_A0B: CON2B2.3 ENA1.4 U$1.2
N_A1: CON2B1.4 U$35.A1 U$43.2
N_A1B: CON2B2.4 ENA1.3 U$40.2
N_A2: CON2B1.5 U$35.A2 U$43.3
N_A2B: CON2B2.5 ENA1.2 U$41.2
N_A3: IH3.K(C) IL3.A U$35.A3 U$43.4
N_A4: U$24.SDA U$35.A4 U$43.5
N_A5: U$24.SCL U$35.A5 U$43.6
N_A6: IH2.K(C) IL2.A U$35.A6 U$43.7
N_A7: IH1.K(C) IL1.A U$35.A7 U$43.8
N_D2: ENA.4 ENC_PULL.2 U$35.D2
N_D3: ENB.4 ENC_PULL.4 U$35.D3
N_D4: ENA.3 ENC_PULL.3 U$35.D4
N_D5: ENB.3 ENC_PULL.5 U$35.D5
N_D6: ATMEGA_2560.D2 RFID1.3 U$35.D6 U$48.1
N_D7: ATMEGA_2560.D4 RFID1.5 U$35.D7 U$48.2
N_D8: U$35.D8 U$48.3
N_D9: CON2A.10 U$35.D9 U$48.4
N_D9B: CON2B.10 IC1.1
N_D10: CON2A.9 U$35.D10 U$48.5
N_D10B: CON2B.9 IC1.2
N_D11: CON2A.8 U$35.D11 U$48.6
N_D11B: CON2B.8 IC1.3
N_D12: U$35.D12 U$48.7
N_D13: U$28.- U$35.D13
N_RST: N_RST.1 U$30.2 U$35.RST
N_RX: BLUETOOTH.1 N-M.1 U$35.RX
N_TX: BLUETOOTH.2 N-M.2 U$35.TX
POS_1: IC2.5 PPR_R1.P$1 U$29.1
R_3V3: 10K.1 RASPI_PORT1.1 RASPI_PORT2.39
R_3V31: RASPI_PORT1.17 RASPI_PORT2.23
R_5V: RASPI_PORT1.2 RASPI_PORT2.40
R_5V1: RASPI_PORT1.4 RASPI_PORT2.38
R_GND: BC547.1(E) IC8.9(EMITTER_1) IC8.11(EMITTER_2) IC8.13(EMITTER_3) IC8.15(EMITTER_4) IC9.2(CATHODE_1) IC9.4(CATHODE_2) IC9.6(CATHODE_3) IC9.8(CATHODE_4) IC10.2(CATHODE_1) IC10.4(CATHODE_2) IC10.6(CATHODE_3) IC10.8(CATHODE_4) OISO2.1 OISO3.1 OISO5.1 RASPI_PORT1.9 RASPI_PORT2.31 TR14.1(E) TR15.1(E) TR16.1(E) U$17.2
R_GND1: RASPI_PORT1.25 RASPI_PORT2.15
R_GND2: RASPI_PORT1.39 RASPI_PORT2.1
R_GND3: RASPI_PORT1.34 RASPI_PORT2.8
R_GND4: RASPI_PORT1.30 RASPI_PORT2.12
R_GND5: RASPI_PORT1.20 RASPI_PORT2.22
R_GND6: RASPI_PORT1.14 RASPI_PORT2.28
R_GND7: RASPI_PORT1.6 RASPI_PORT2.36
RESET: C2.2 CEL2RO1.P$1 IC3.1 MEGA_RST1.1
RO1: REL1.OUT_1 U$18.VDD U$25.2
RO2: REL2.OUT_1 U$19.VDD U$26.2
RO3: REL3.OUT_1 U$20.VDD U$27.2
RST: ATMEGA_2560.RST MEGA_RST.1 U$12.RST1 U$30.C
RST1: ATMEGA_2560.RST1 U$12.RST
RX0: ATMEGA_2560.RX0 RFID1.1 U$12.RX0(RX)
RX1: ATMEGA_2560.RX1 N-M.3 RFID2.3 SW1.1
RX2: ATMEGA_2560.RX2 RFID2.5 SW1.3
RX3: ATMEGA_2560.RX3 RFID2.7 SW1.5
RXD: IC3.2 JP3.3 U$52.10
S_A0: IC3.23 U$53.6
S_A1: IC3.24 U$53.5
S_A2: IC3.25 U$53.4
S_A3: IC3.26 U$53.3
S_A4: IC3.27 U$53.2
S_A5: IC3.28 U$53.1
S_AREF: C8.1 IC3.21
S_D2: IC3.4 U$52.8
S_D3: IC3.5 U$52.7
S_D4: IC3.6 U$52.6
S_D5: IC3.11 U$52.5
S_D6: IC3.12 U$52.4
S_D7: IC3.13 U$52.3
S_D8: IC3.14 U$52.2
S_D9: IC3.15 U$52.1
S_D10: IC3.16 U$53.10
S_D11: IC3.17 U$53.9
S_D12: IC3.18 U$53.8
S_D13: IC3.19 U$53.7
S_G: BAT_SUPP.1 EM_SW.2
S_GND: BAT6.2 C5.2 C6.1 C7.1 C8.2 IC3.8 IC3.22 JP3.6 MEGA_RST1.3 U$51.2
SCK: ATMEGA_2560.SCK U$12.SCK(SC)
SCL: ATMEGA_2560.SCL RFID2.1 U$10.SCL
SCLU: ATMEGA_2560.SCLU U$12.SCL
SDA: ATMEGA_2560.SDA RFID2.2 U$10.SDA
SDAU: ATMEGA_2560.SDAU U$12.SDA
STAT_1: CEL1CC.A CEL1CO.K(C) U$18.STAT
STAT_2: CEL2CC.A CEL2CO.K(C) U$19.STAT
STAT_3: CEL3CC.A CEL3CO.K(C) U$20.STAT
SUPP+: BAT_SUPP.2 FUSE.IN
TX0: ATMEGA_2560.TX0 RFID1.2 U$12.TX0(TX)
TX1: ATMEGA_2560.TX1 N-M.4 RFID2.4 SW1.2
TX2: ATMEGA_2560.TX2 RFID2.6 SW1.4
TX3: ATMEGA_2560.TX3 RFID2.8 SW1.6
TXD: IC3.3 JP3.2 U$52.9
U1: IC1.16 L1.K(C) REL1.- ULN_SIG.3
U2: IC1.15 L2.K(C) REL2.- ULN_SIG.2
U3: IC1.14 L3.K(C) REL3.- ULN_SIG.1
U4: IC1.13 L4.K(C) U45.2
U5: IC1.12 L5.K(C) U45.1
U6: IC1.11 L6.K(C) U67.2
U7: IC1.10 L7.K(C) U67.1
V_SUPP: BAT1.1 IC1.9 IC2.8 LSA_2.9 PROX1.3 PROX2.3 PROX3.3 REL1.+ REL2.+ REL3.+ U$3.IN+ U$6.IN+ U$7.IN+ U$8.IN+ U$9.IN+ U$13.IN+ U$32.O1
VBAT_1: BALANCE1.4 BALANCE.4 R2.P$1 U$18.VBAT U$21.2
VBAT_2: BALANCE1.3 BALANCE.3 R35.P$1 U$19.VBAT U$21.1 U$22.2
VBAT_3: BALANCE1.2 BALANCE.2 R37.P$1 U$20.VBAT U$22.1 U$23.2
XTAL1: C6.2 IC3.9 Q3.2
XTAL2: C7.2 IC3.10 Q3.1
Unconnected: C_GND.3 IC2.1 IC2.2 IC2.3 REL1.OUT_2 REL2.OUT_2 REL3.OUT_2 RFID.4 U$2.D0 U$2.D1 U$2.D2 U$2.D3 U$3.CS U$6.CS U$9.CS U$10.3V3 U$10.DRDY U$10.FSY(FSYNC) U$10.IA(INTA) U$11.EN U$11.ST(STATE) U$14.O2 U$15.O2 U$16.O2 U$32.O2 U$54.1 U$55.1 U$56.1 U$57.1 U$58.1 U$59.1 U$60.1 U$61.1 U$63.1 U$64.1

### Notes on the sheet
- ARDUINO MEGA | OPTO ISOLATOR
- VNH 2SP30 MOTOR DRIVER
- USB HOST SHIELD
- ESP8266 NODE MCU
- VNH 2SP30 MOTOR DRIVER
- OPTO ISOLATOR
- BUCK LM2596
- BUZZER | BOOSTER XL6009
- RASPBERRY PI 3B | VNH 2SP30 MOTOR DRIVER
- PROXIMITY SENSOR
- RELAY
- OPTO ISOLATOR
- ULN2003 | ARDUINO NANO
- PROXIMITY SENSOR
- CHARGING
- SHARP SENSOR
- I2C DISPLAY | CHARGING INDICATION
- BLUETOOTH MODULE | PROXIMITY SENSOR
- ENCODER
- GY 87 IMU | DIP SWITCHES
- RFID
- LSA08 LINE SENSOR
- SERVO | DAC
- BUCK XL 4015
- SUPPLY
- PARALLEL CONNECTION | DRILLS
- FUSE
- COMMON GND
- 16 X 2 LCD DISPLAY | PARALLEL CONNECTION
- RESET COMMON JMP
- ATMEGA 328 P | VOLTAGE DETECTION
- STAR GROUND

## Sheet 2 of 3

## Sheet 3 of 3

## Library data of the parts
10K RN6 RN7 = resistor-sil:G08R: SIL RESISTOR; OC_FARNELL: unknown; OC_NEWARK: unknown
A B BAT_SUPP CS EM_SW M1-M3 U45 U67 = AB_Right_angle_terminal_block:AB_RIGHT_TER_BLK
ATMEGA_2560 = AB_Arduino_Mega_updated 29-07-2019:AB_ARDUINO_MEGA
BALANCE BALANCE1 ENA ENA1 ENB U$49 = AB_LOCKING CONNECTORS:AB_4PIN_LOC_CONNECTOR
BAT1 BAT6 U$36 = AB_SCREW_TER_5MM_2PIN_BIG:AB_SCREW_TERMINAL_5MM_2PIN
BC547 TR14-TR24 = transistor:BC547: NPN TRANSISTOR
BLUETOOTH N-M = special:SW_DIP-2: DIP SWITCH
C1-C8 = cap-master:CNP-: NON-POLARIZED CAP
C_GND = AB_Star_GND:AB_JOINT_GND
CEL1CC CEL1CO CEL2CC CEL2CO CEL3CC CEL3CO D1-D3 IH1-IH3 IL1-IL3 L1-L7 = SparkFun-LED:LED: LED (Generic) Standard schematic elements and footprints for 5mm, 3mm, 1206, and 0603 sized LEDs. Generic LEDs with no color specified.
CEL1RC CEL1RO CEL2RC CEL2RO CEL2RO1 CEL3RC CEL3RO IRH1-IRH3 IRL1-IRL3 PPR_R1 R2 R4-R7 R10 R11 R17-R28 R32 R34-R38 = SparkFun-Resistors:RESISTOR: Generic Resistor Package
CON1A CON1B CON2A CON2B CON2B1 CON2B2 U$52 U$53 = AB_LOCKING CONNECTORS:AB_10PIN_LOC_CONNECTOR
ENC_PULL = resistor-sil:G04R: SIL RESISTOR; OC_FARNELL: unknown; OC_NEWARK: unknown
FUSE = AB_FUSE_HOLDER:AB_FUSE_HOLDER
G_P2 = pot:TRIM_EU-: POTENTIOMETER
IC1 = ic-package:DIL16: Dual In Line / Socket
IC2 = ic-package:DIL8: Dual In Line / Socket; SPICEPREFIX: X
IC3 = ic-package:DIL28: Dual In Line
IC8-IC10 = tlp281:TLP281-4(GB,J,F): Photocoupler Transistor 80V 100% SOIC16 Toshiba TLP281-4(GB,J,F) AC/DC Input, Transistor Output Quad Optocoupler, Surface Mount, 16-Pin SOP Source: Datasheet <http://toshiba.semicon-storage.com/info/docget.jsp?did=16753&prodName=TLP281.pdf>; DESCRIPTION: Photocoupler Transistor 80V 100% SOIC16 Toshiba TLP281-4(GB,J,F) AC/DC Input, Transistor Output Quad Optocoupler, Surface Mount, 16-Pin SOP; HEIGHT: 2.1mm; MANUFACTURER_NAME: Toshiba; MANUFACTURER_PART_NUMBER: TLP281-4(GB,J,F); MOUSER_PART_NUMBER: 757-TLP281-4(GB,J,F); MOUSER_PRICE-STOCK: https://www.mouser.com/Search/Refine.aspx?Keyword=757-TLP281-4%28GB%2CJ%2CF%29; RS_PART_NUMBER: 7603227P; RS_PRICE-STOCK: http://uk.rs-online.com/web/p/products/7603227P
JP1 = pinhead:PINHD-1X1: PIN HEADER
JP2 = pinhead:PINHD-2X14: PIN HEADER
JP3 = pinhead:PINHD-1X6: PIN HEADER
LSA_2 = con-3m-skt-header:SOCKET-10: 10 pin PCB Socket (3m 85xx/51xx)
M_RST MEGA_RST MEGA_RST1 N_RST = SparkFun-Switches:MOMENTARY-SWITCH-SPST: Momentary Switch (Pushbutton) - SPST Normally-open (NO) SPST momentary switches (buttons, pushbuttons). Variants PTH-12MM - 12mm square, through-hole Momentary Pushbutton Switch - 12mm Square <https://www.sparkfun.com/products/9190> (COM-09190) PTH-6.0MM, PTH-6.0MM-KIT - 6.0mm square, through-hole Mini Pushbutton Switch <https://www.sparkfun.com/products/97> (COM-00097) KIT package intended for soldering kit's - only one side of pads' copper is exposed. PTH-RIGHT-ANGLE-KIT - Right-angle, through-hole Right Angle Tactile Button <https://www.sparkfun.com/products/10791> - Used on SparkFun BigTime Watch Kit <https://www.sparkfun.com/products/11734> SMD-12MM - 12mm square, surface-mount Tactile Button - SMD (12mm) <https://www.sparkfun.com/products/12993> (COM-12993) Used on SparkFun PicoBoard <https://www.sparkfun.com/products/11888> SMD-4.5MM - 4.5mm Square Trackball Switch Used on SparkFun Blackberry Trackballer Breakout <https://www.sparkfun.com/products/13169> SMD-4.6MMX2.8MM - 4.60mm x 2.80mm, surface mount Used on SparkFun SAMD21 Mini Breakout <https://www.sparkfun.com/products/13664> SMD-5.2MM, SMD-5.2-REDUNDANT - 5.2mm square, surface-mount Mini Pushbutton Switch - SMD <https://www.sparkfun.com/products/8720> (COM-08720) Used on Arduino Pro Mini <https://www.sparkfun.com/products/11114> REDUNDANT package connects both switch circuits together SMD-6.0X3.5MM - 6.0 x 3.5mm, surface mount Momentary Reset Switch SMD <https://www.sparkfun.com/products/8229> (COM-08229) SMD-6.2MM-TALL - 6.2mm square, surface mount Tactile Button - SMD (6mm) <https://www.sparkfun.com/products/12992> Used on SparkFun Digital Sandbox <https://www.sparkfun.com/products/12651> SMD-RIGHT-ANGLE - Right-angle, surface mount Used on SparkFun Block for Intel® Edison - Arduino <https://www.sparkfun.com/products/13036>; PROD_ID: SWCH-08441; SF_SKU: COM-00097
NANO NODEMCU U$1 U$17 U$31 U$33 U$40 U$41 U$50 U$51 U$62 = AB_SMD_JUMPER:AB_JUMPER_ONE_WAY
OISO1-OISO6 U$45 = AB_LOCKING CONNECTORS:AB_5PIN_LOC_CONNECTOR; SPICEPREFIX: X
PROX1-PROX3 V-P = AB_Right_angle_terminal_block:AB_RIGHT_TER_BLK_3PIN
Q3 = crystal:CRYSTAL: CRYSTAL; OC_FARNELL: 1666969; OC_NEWARK: unknown
RASPI_PORT1 RASPI_PORT2 = pinhead:PINHD-2X20: PIN HEADER
REL1-REL3 = AB_ELECTROMAGNETIC _RELAY:AB_ELECTROMAGNETIC_RELAY
RFID RFID1-RFID4 U$43 = AB_LOCKING CONNECTORS:AB_8PIN_LOC_CONNECTOR
RN1 = resistor-sil:G07R: SIL RESISTOR; OC_FARNELL: unknown; OC_NEWARK: unknown
SERVO1-SERVO4 SHARP1-SHARP3 ULN_SIG = AB_LOCKING CONNECTORS:AB_3PIN_LOC_CONNECTOR
SW1 = special:SW_DIP-6: DIP SWITCH
U$2 = AB_16X2_LCD_DISPLAY:AB_16X2_LCD_DISPLAY
U$3 U$6 U$9 = AB_VNH2SP30_DRIVER_updated 29-07-2019:AB_VNH2SP30
U$4 = AB_ESP8266_Node_MCU_updated 29-07-2019:ESP8266_NODEMCU_BY_AB
U$5 = AB_RASPBERRY_PI_Updated 29-07-2019:AB_RASPBERRY_PI_3
U$7 = AB_Voltage_converters_updated 29-07-2019:AB_LM2596_BUCK_CONVERTER
U$8 = AB_Voltage_converters_updated 29-07-2019:AB_XL6009_BOOST_CONVERTER
U$10 = AB_GY87 updated 1-08-2019:AB_GY87
U$11 = AB_BLUETOOTH_HC05:AB_BLUETOOTH_HC05
U$12 = AB_ARDUINO_USB_HOST_SHIELD_updated 29-07-2019:AB_USB_HOST_SHIELD_ARDUINO
U$13 = AB_XL4015_5A_BUCK_DISPLAY_updated 29-07-2019:AB_XL4015_5A_
U$14-U$16 U$32 = spdt switch:AB_SW
U$18-U$20 = AB_mcp 73831_LIPO_Charger:AB_MCP_73831_LIPO_CHARGER
U$21-U$23 U$25-U$27 U$29 U$34 U$37 U$38 = AB_POL_CAP:AB_POL_CAP
U$24 = AB_0.91_INCH_I2C_DISPLAY:AB_0.91_INCH_I2C_DISPLAY
U$28 U$39 = AB_BUZZER:AB_BUZZER
U$30 = AB_SMD_JUMPER:AB_JUMPER_TWO_WAY
U$35 = AB_ARDUINO NANO 2-06-2019 11.17:AB_ARDUINO_NANO
U$42 U$48 = AB_LOCKING CONNECTORS:AB_7PIN_LOC_CONNECTOR
U$44 U$46 U$47 = AB_7805_FLAT:AB_7805_FLAT
U$54-U$61 U$63 U$64 = AB_ plated drill 160 mil:AB_PLATED_DRILL_160MIL

## Net classes
0 default: width 0.305 mm, drill 0.203 mm, clearance 0.203 mm
1 V_SUPP: width 5.08 mm, drill 2.032 mm, clearance 0.406 mm
2 GND: width 0.508 mm, drill 0.203 mm, clearance 0.305 mm
5 5V: width 0.762 mm, drill 0.406 mm, clearance 0.305 mm
6 7V: width 1.778 mm, drill 0.762 mm, clearance 0.305 mm